# EAGLE design ButtonBreakout (EAGLE 9.5.1)
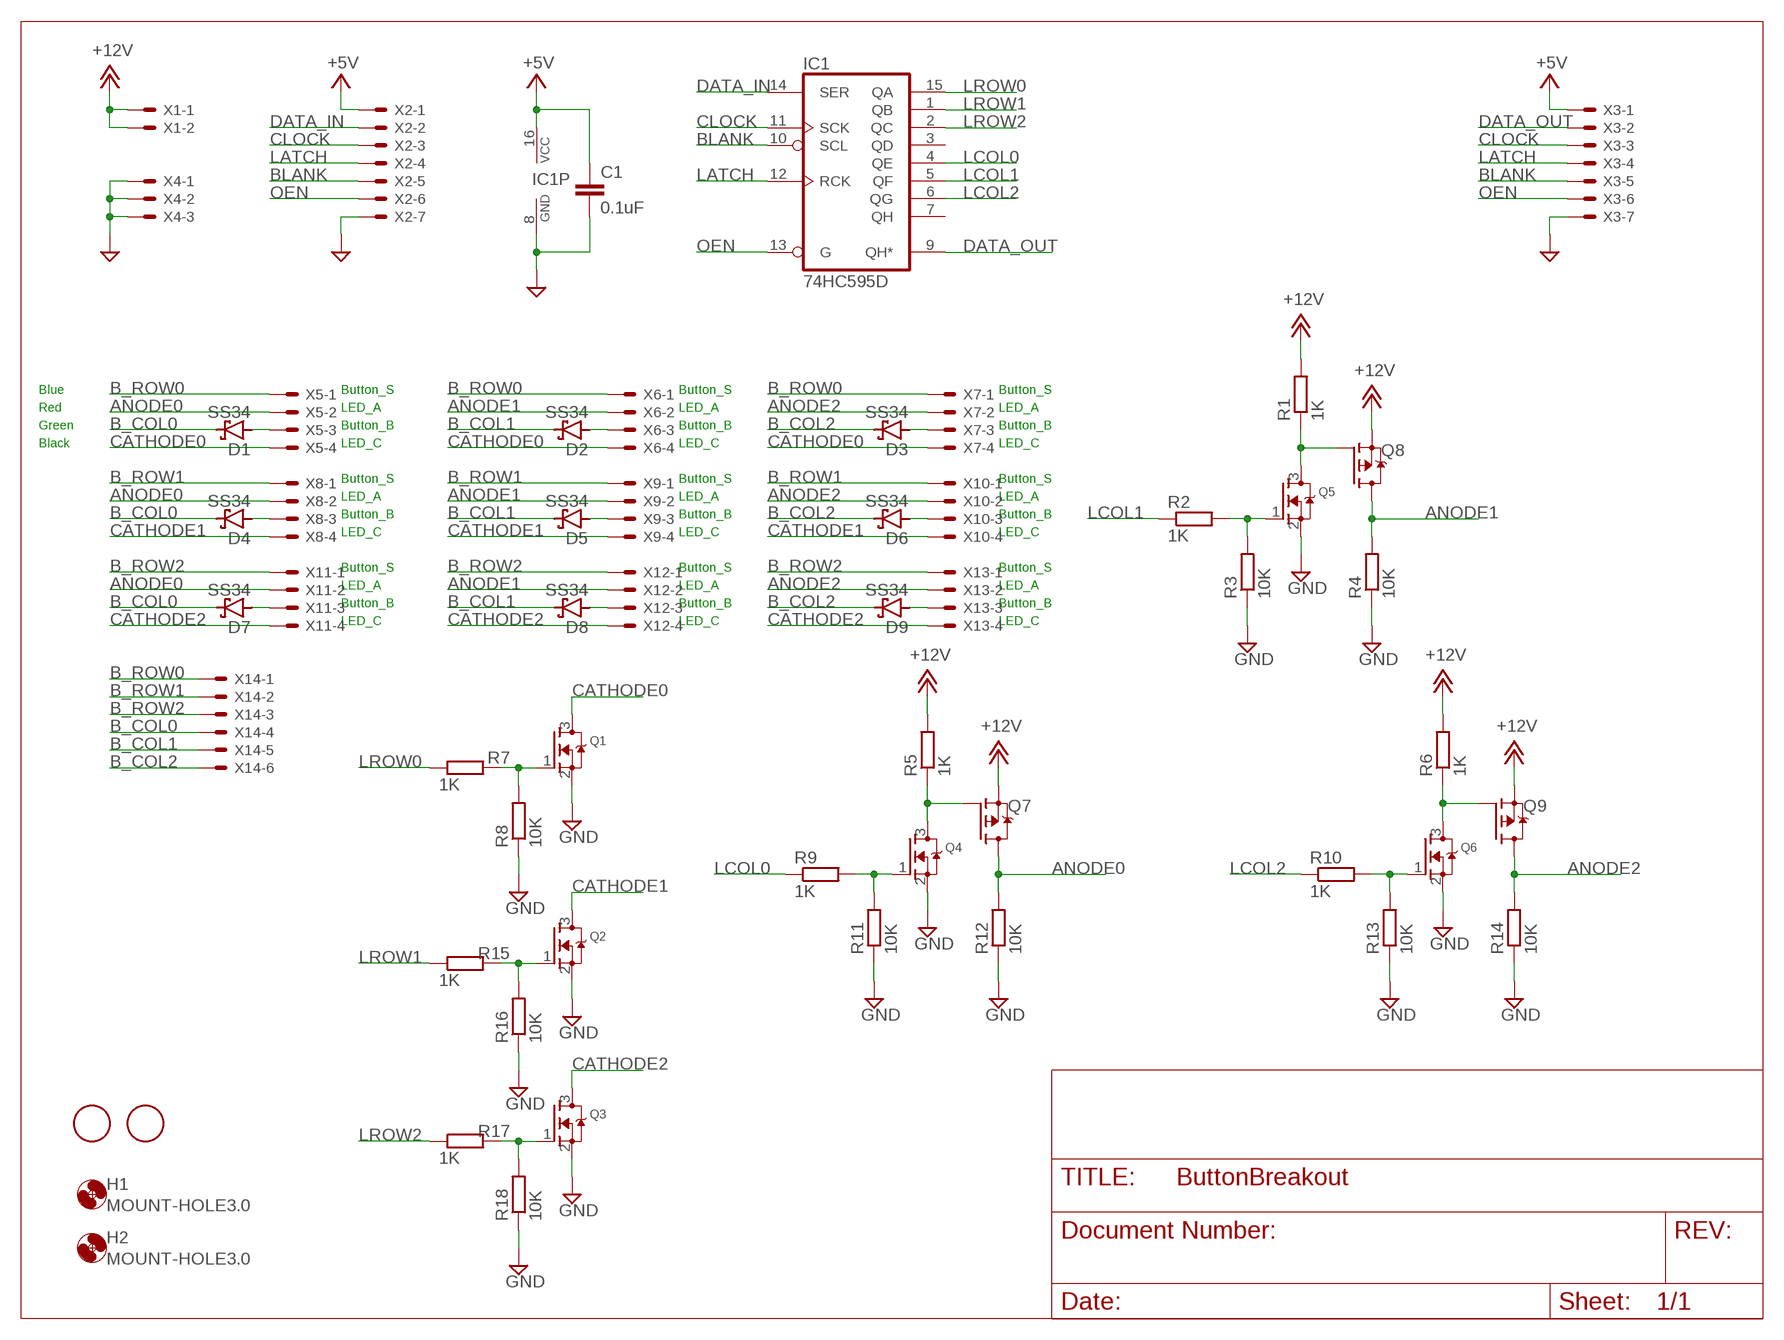
[diagram p0: schematic, sheet 1]

## Parts
C1  0.1uF  C-EUC0805  [C0805]
D1  SS34  [SMA]
D2  SS34  [SMA]
D3  SS34  [SMA]
D4  SS34  [SMA]
D5  SS34  [SMA]
D6  SS34  [SMA]
D7  SS34  [SMA]
D8  SS34  [SMA]
D9  SS34  [SMA]
F1  FIDUCIAL  [FIDUCIAL_1MM]
F2  FIDUCIAL  [FIDUCIAL_1MM]
H1  MOUNT-HOLE3.0  [3,0]
H2  MOUNT-HOLE3.0  [3,0]
IC1  74HC595D  [SO16]
Q1  AO3414SOT23  [SOT95P240X110-3N]
Q2  AO3414SOT23  [SOT95P240X110-3N]
Q3  AO3414SOT23  [SOT95P240X110-3N]
Q4  AO3414SOT23  [SOT95P240X110-3N]
Q5  AO3414SOT23  [SOT95P240X110-3N]
Q6  AO3414SOT23  [SOT95P240X110-3N]
Q7  AO3415  [SOT95P240X110-3N]
Q8  AO3415  [SOT95P240X110-3N]
Q9  AO3415  [SOT95P240X110-3N]
R1  1K  R-EU_R0805  [R0805]
R2  1K  R-EU_R0805  [R0805]
R3  10K  R-EU_R0805  [R0805]
R4  10K  R-EU_R0805  [R0805]
R5  1K  R-EU_R0805  [R0805]
R6  1K  R-EU_R0805  [R0805]
R7  1K  R-EU_R0805  [R0805]
R8  10K  R-EU_R0805  [R0805]
R9  1K  R-EU_R0805  [R0805]
R10  1K  R-EU_R0805  [R0805]
R11  10K  R-EU_R0805  [R0805]
R12  10K  R-EU_R0805  [R0805]
R13  10K  R-EU_R0805  [R0805]
R14  10K  R-EU_R0805  [R0805]
R15  1K  R-EU_R0805  [R0805]
R16  10K  R-EU_R0805  [R0805]
R17  1K  R-EU_R0805  [R0805]
R18  10K  R-EU_R0805  [R0805]
X1  JST-XH-02-PIN-LONG-PAD  [JST-XH-02-PACKAGE-LONG-PAD]
X2  JST-XH-07-PIN-LONG-PAD  [JST-XH-07-PACKAGE-LONG-PAD]
X3  JST-XH-07-PIN-LONG-PAD  [JST-XH-07-PACKAGE-LONG-PAD]
X4  JST-XH-03-PIN-LONG-PAD  [JST-XH-03-PACKAGE-LONG-PAD]
X5  JST-XH-04-PIN-LONG-PAD  [JST-XH-04-PACKAGE-LONG-PAD]
X6  JST-XH-04-PIN-LONG-PAD  [JST-XH-04-PACKAGE-LONG-PAD]
X7  JST-XH-04-PIN-LONG-PAD  [JST-XH-04-PACKAGE-LONG-PAD]
X8  JST-XH-04-PIN-LONG-PAD  [JST-XH-04-PACKAGE-LONG-PAD]
X9  JST-XH-04-PIN-LONG-PAD  [JST-XH-04-PACKAGE-LONG-PAD]
X10  JST-XH-04-PIN-LONG-PAD  [JST-XH-04-PACKAGE-LONG-PAD]
X11  JST-XH-04-PIN-LONG-PAD  [JST-XH-04-PACKAGE-LONG-PAD]
X12  JST-XH-04-PIN-LONG-PAD  [JST-XH-04-PACKAGE-LONG-PAD]
X13  JST-XH-04-PIN-LONG-PAD  [JST-XH-04-PACKAGE-LONG-PAD]
X14  JST-XH-06-PIN-LONG-PAD  [JST-XH-06-PACKAGE-LONG-PAD]

## Nets
+5V: C1.1 IC1.16(VCC) X2.1 X3.1
+12V: Q7.2(S) Q8.2(S) Q9.2(S) R1.2 R5.2 R6.2 X1.1 X1.2
ANODE0: Q7.3(D) R12.2 X5.2 X8.2 X11.2
ANODE1: Q8.3(D) R4.2 X6.2 X9.2 X12.2
ANODE2: Q9.3(D) R14.2 X7.2 X10.2 X13.2
B_COL0: D1.C D4.C D7.C X14.4
B_COL1: D2.C D5.C D8.C X14.5
B_COL2: D3.C D6.C D9.C X14.6
B_ROW0: X5.1 X6.1 X7.1 X14.1
B_ROW1: X8.1 X9.1 X10.1 X14.2
B_ROW2: X11.1 X12.1 X13.1 X14.3
BLANK: IC1.10(SCL) X2.5 X3.5
CATHODE0: Q1.3(D) X5.4 X6.4 X7.4
CATHODE1: Q2.3(D) X8.4 X9.4 X10.4
CATHODE2: Q3.3(D) X11.4 X12.4 X13.4
CLOCK: IC1.11(SCK) X2.3 X3.3
DATA_IN: IC1.14(SER) X2.2
DATA_OUT: IC1.9(QH*) X3.2
GND: C1.2 IC1.8(GND) Q1.2(S) Q2.2(S) Q3.2(S) Q4.2(S) Q5.2(S) Q6.2(S) R3.1 R4.1 R8.1 R11.1 R12.1 R13.1 R14.1 R16.1 R18.1 X2.7 X3.7 X4.1 X4.2 X4.3
LATCH: IC1.12(RCK) X2.4 X3.4
LCOL0: IC1.4(QE) R9.1
LCOL1: IC1.5(QF) R2.1
LCOL2: IC1.6(QG) R10.1
LROW0: IC1.15(QA) R7.1
LROW1: IC1.1(QB) R15.1
LROW2: IC1.2(QC) R17.1
N$1: Q2.1(G) R15.2 R16.2
N$2: Q3.1(G) R17.2 R18.2
N$3: Q5.3(D) Q8.1(G) R1.1
N$4: Q5.1(G) R2.2 R3.2
N$5: Q1.1(G) R7.2 R8.2
N$6: Q4.3(D) Q7.1(G) R5.1
N$7: D1.A X5.3
N$8: D2.A X6.3
N$9: D3.A X7.3
N$10: D4.A X8.3
N$11: D5.A X9.3
N$12: D6.A X10.3
N$13: D7.A X11.3
N$14: D8.A X12.3
N$15: D9.A X13.3
N$16: Q4.1(G) R9.2 R11.2
N$17: Q6.3(D) Q9.1(G) R6.1
N$18: Q6.1(G) R10.2 R13.2
OEN: IC1.13(G) X2.6 X3.6
Unconnected: IC1.3(QD) IC1.7(QH)

## Notes on the sheet
- Blue | Button_S | Button_S | Button_S
- Red | LED_A | LED_A | LED_A
- Green | Button_B | Button_B | Button_B
- Black | LED_C | LED_C | LED_C
- Button_S | Button_S | Button_S
- LED_A | LED_A | LED_A
- Button_B | Button_B | Button_B
- LED_C | LED_C | LED_C
- Button_S | Button_S | Button_S
- LED_A | LED_A | LED_A
- Button_B | Button_B | Button_B
- LED_C | LED_C | LED_C

## Library data of the parts
C1 = rcl:C-EU: CAPACITOR, European symbol; SPICEPREFIX: C
D1-D9 = tmc:SS34
F1 F2 = ECE388:FIDUCIAL: For use by pick and place machines to calibrate the vision/machine, 1mm By microbuilder.eu
H1 H2 = holes:MOUNT-HOLE: MOUNTING HOLE with drill center marker
IC1 = 74xx-eu:74*595: 8-bit SHIFT REGISTER, output latch
Q1-Q6 = tmc:AO3414
Q7-Q9 = tmc:AO3415
R1-R18 = rcl:R-EU_: RESISTOR, European symbol; SPICEPREFIX: R
X1 = Rembrandt Electronics - JST XH Connectors v1-0:JST-XH-02-PIN: JST XH Connector 2 Pin Wire to board connector. Pitch: 2,54 mm, (0.100") Number of pins: 2 Created by Rembrandt Electronics www.rembrandtelectronics.com
X2 X3 = Rembrandt Electronics - JST XH Connectors v1-0:JST-XH-07-PIN: JST XH Connector 2 Pin Wire to board connector. Pitch: 2,54 mm, (0.100") Number of pins: 7 Created by Rembrandt Electronics www.rembrandtelectronics.com
X4 = Rembrandt Electronics - JST XH Connectors v1-0:JST-XH-03-PIN: JST XH Connector 2 Pin Wire to board connector. Pitch: 2,54 mm, (0.100") Number of pins: 3 Created by Rembrandt Electronics www.rembrandtelectronics.com
X5-X13 = Rembrandt Electronics - JST XH Connectors v1-0:JST-XH-04-PIN: JST XH Connector 2 Pin Wire to board connector. Pitch: 2,54 mm, (0.100") Number of pins: 4 Created by Rembrandt Electronics www.rembrandtelectronics.com
X14 = Rembrandt Electronics - JST XH Connectors v1-0:JST-XH-06-PIN: JST XH Connector 2 Pin Wire to board connector. Pitch: 2,54 mm, (0.100") Number of pins: 6 Created by Rembrandt Electronics www.rembrandtelectronics.com

## Board
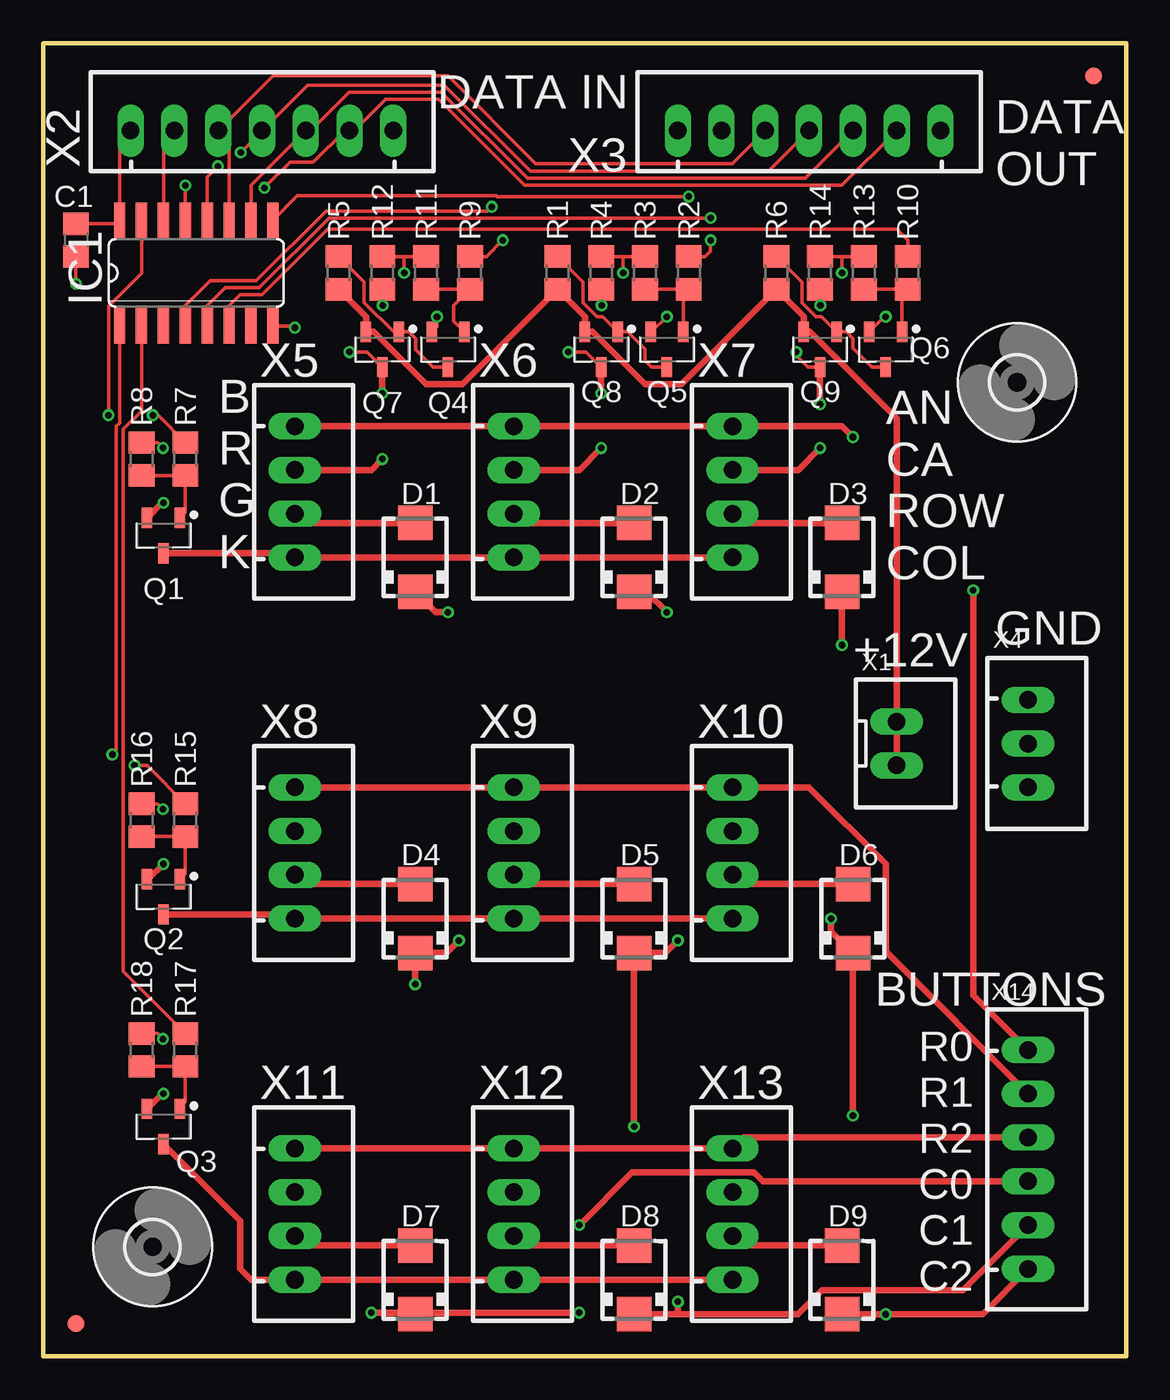
[diagram p1: board, top side]
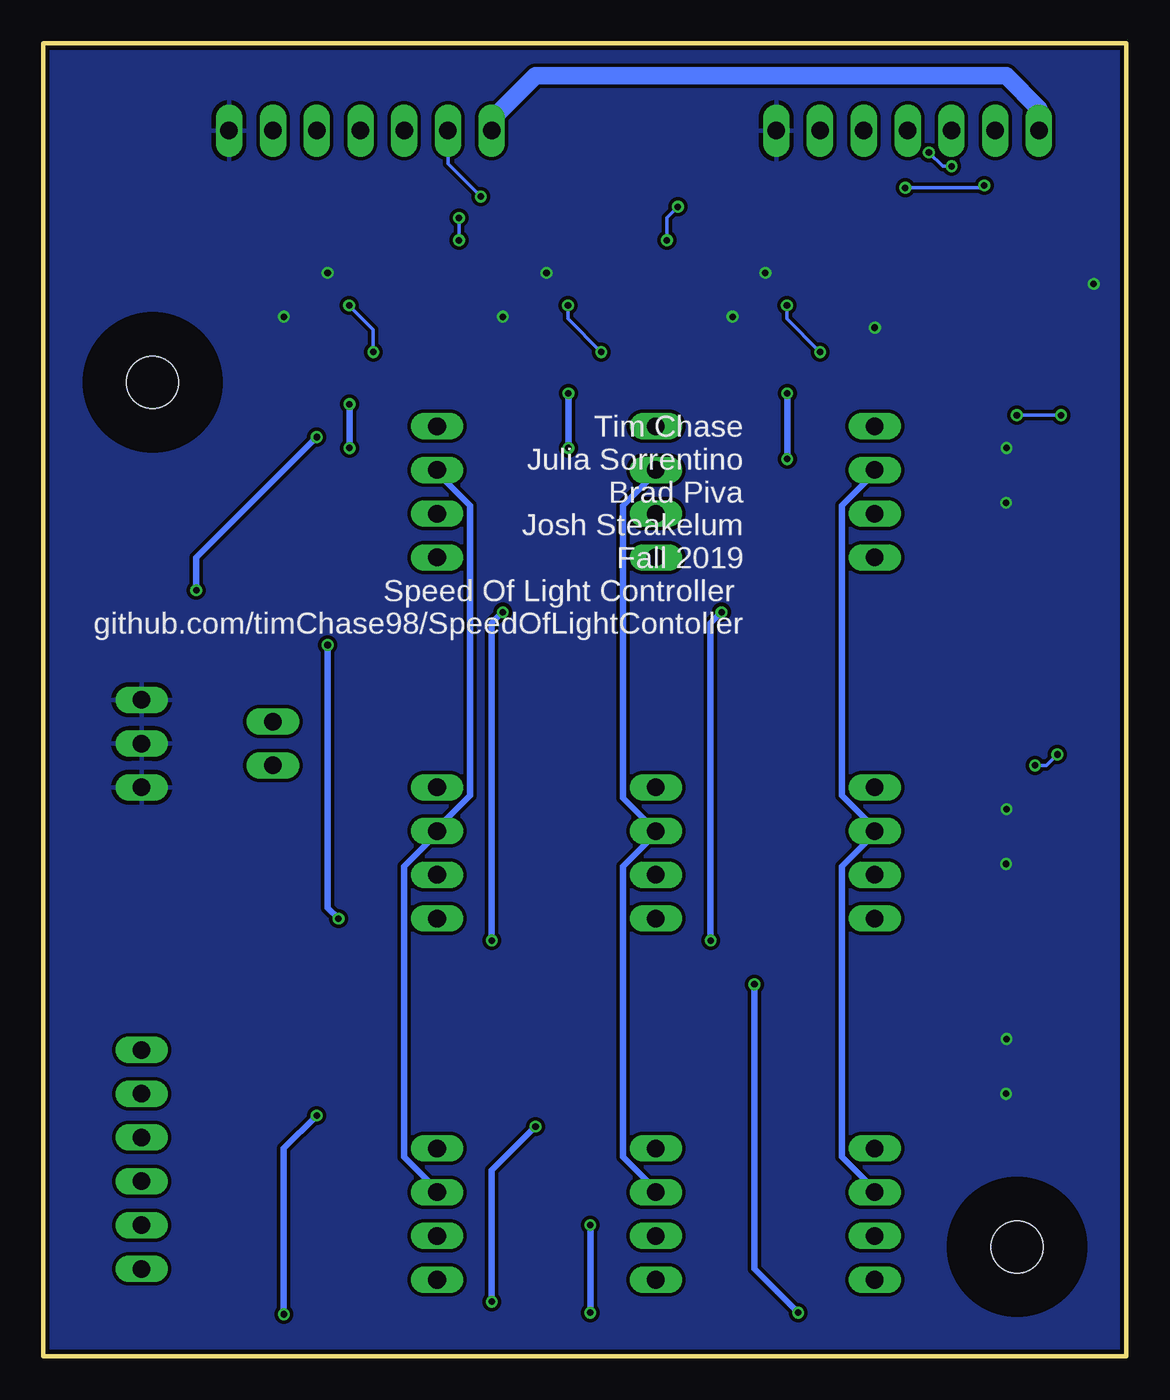
[diagram p2: board, bottom side, seen from below]

Size 62.87 x 76.2 mm. Coordinates in mm from the lower left corner, seen from the top.
Outline: 0,0 62.87,0 62.87,76.2 0,76.2 0,0
Copper layers (1*16): Top 0.035mm / dielectric 1.5mm / Bottom 0.035mm
Design rules "Dirty8TS": minimum track width 8mil, minimum drill 15mil, track to track 8mil, track to pad 8mil, pad to pad 8mil, via to via 8mil, smd to smd 0mil, copper to edge 10mil, drill to drill 10mil, minimum pad ring 10mil, minimum via ring 6mil, stop-mask expansion 2mil, vias tented up to drill 25mil, thermal gap 10mil

### Footprints (pad centres in the part's own frame; a part is rotated, then mirrored left to right if it is on the bottom)
C0805 = smd 1.3 x 1.5: 1 -0.95,0; 2 0.95,0
SMA = smd 2 x 2: A 2,0; C -2,0
FIDUCIAL_1MM = smd 1 x 1: 1 0,0
3,0 = hole 3: 0,0
SO16 = smd 0.66 x 2.032: 1 -4.445,-3.073; 2 -3.175,-3.073; 3 -1.905,-3.073; 4 -0.635,-3.073; 5 0.635,-3.073; 6 1.905,-3.073; 7 3.175,-3.073; 8 4.445,-3.073; 9 4.445,3.073; 10 3.175,3.073; 11 1.905,3.073; 12 0.635,3.073; 13 -0.635,3.073; 14 -1.905,3.073; 15 -3.175,3.073; 16 -4.445,3.073
SOT95P240X110-3N = smd 1.18 x 0.609: 1 -1.024,0.95; 2 -1.024,-0.95; 3 1.024,0
R0805 = smd 1.3 x 1.5: 1 -0.95,0; 2 0.95,0
JST-XH-02-PACKAGE-LONG-PAD = drill 1.016 long: 1 -1.27,0; 2 1.27,0
JST-XH-07-PACKAGE-LONG-PAD = drill 1.016 long: 1 -7.62,0; 2 -5.08,0; 3 -2.54,0; 4 0,0; 5 2.54,0; 6 5.08,0; 7 7.62,0
JST-XH-03-PACKAGE-LONG-PAD = drill 1.016 long: 1 -2.54,0; 2 0,0; 3 2.54,0
JST-XH-04-PACKAGE-LONG-PAD = drill 1.016 long: 1 -3.81,0; 2 -1.27,0; 3 1.27,0; 4 3.81,0
JST-XH-06-PACKAGE-LONG-PAD = drill 1.016 long: 1 -6.35,0; 2 -3.81,0; 3 -1.27,0; 4 1.27,0; 5 3.81,0; 6 6.35,0

### Placement (x,y rotation side)
C1  1.91,64.77 270 top
D1  21.59,46.35 90 top
D2  34.29,46.35 90 top
D3  46.35,46.35 90 top
D4  21.59,25.4 90 top
D5  34.29,25.4 90 top
D6  46.99,25.4 90 top
D7  21.59,4.45 90 top
D8  34.29,4.45 90 top
D9  46.35,4.45 90 top
F1  1.91,1.91 0 top
F2  60.96,74.3 0 top
H1  6.35,6.35 0 top
H2  56.52,56.52 0 top
IC1  8.89,62.87 0 top
Q1  6.99,47.62 270 top
Q2  6.99,26.67 270 top
Q3  6.99,13.34 270 top
Q4  23.5,58.42 270 top
Q5  36.2,58.42 270 top
Q6  48.9,58.42 270 top
Q7  19.68,58.42 270 top
Q8  32.38,58.42 270 top
Q9  45.09,58.42 270 top
R1  29.84,62.87 270 top
R2  37.47,62.87 270 top
R3  34.92,62.87 270 top
R4  32.38,62.87 270 top
R5  17.14,62.87 270 top
R6  42.55,62.87 270 top
R7  8.26,52.07 270 top
R8  5.71,52.07 270 top
R9  24.77,62.87 270 top
R10  50.16,62.87 270 top
R11  22.23,62.87 270 top
R12  19.68,62.87 270 top
R13  47.62,62.87 270 top
R14  45.09,62.87 270 top
R15  8.26,31.11 270 top
R16  5.71,31.11 270 top
R17  8.26,17.78 270 top
R18  5.71,17.78 270 top
X1  49.53,35.56 270 top
X2  12.7,71.12 0 top
X3  44.45,71.12 0 top
X4  57.15,35.56 270 top
X5  14.61,50.16 270 top
X6  27.3,50.16 270 top
X7  40.01,50.16 270 top
X8  14.61,29.21 270 top
X9  27.3,29.21 270 top
X10  40.01,29.21 270 top
X11  14.61,8.26 270 top
X12  27.3,8.26 270 top
X13  40.01,8.26 270 top
X14  57.15,11.43 270 top

### Tracks (layer width: path | path; a pad name or v marks a point on that pad's centre or on a via)
+5V
  Top 0.203: X2.1 4.45,70.48 IC1.16 4.23,65.72 C1.1
  Bottom 1.016: X3.1 36.83,71.75 34.29,74.3 6.99,74.3 5.08,72.39 X2.1
+12V
  Top 0.381: R5.2 18.73,60.33 Q7.2 19.18,59.44 22.22,56.41 24.34,56.41 R1.2 31.43,60.33 Q8.2 31.88,59.44 34.92,56.41 37.04,56.41 R6.2 44.13,60.33 Q9.2 44.49,59.44 49.53,54.4 X1.1 X1.2
ANODE0  (via drill 0.38)
  Top 0.203: v19.7,60.98 19.68,61 R12.2 | Q7.3 18.81,58.27 v17.78,58.27
  Top 0.381: Q7.3 v19.68,55.88 | v19.68,52.07 19.05,51.44 X5.2
  Bottom 0.203: v17.78,58.27 19.7,60.2 v19.7,60.98
  Bottom 0.381: X5.2 14.61,51.29 16.52,49.37 16.52,32.54 14.61,30.62 X8.2 14.61,30.34 16.52,28.42 16.52,11.59 14.61,9.67 X11.2 | v19.68,55.88 v19.68,52.07
ANODE1  (via drill 0.38)
  Top 0.203: v32.41,60.98 32.38,61 R4.2 | Q8.3 31.51,58.27 v30.48,58.27
  Top 0.381: Q8.3 v32.38,55.88 | v32.38,52.7 31.11,51.44 X6.2
  Bottom 0.203: v30.48,58.27 32.41,60.2 v32.41,60.98
  Bottom 0.381: X6.2 27.3,51.29 29.22,49.37 29.22,32.4 X9.2 27.3,30.34 29.22,28.42 29.22,11.59 27.3,9.67 X12.2 | v32.38,55.88 v32.38,52.7
ANODE2  (via drill 0.38)
  Top 0.203: v45.1,60.98 45.09,61 R14.2 | Q9.3 44.37,57.4 43.7,58.07 v43.7,58.27
  Top 0.381: Q9.3 v45.09,55.24 | v45.09,52.7 43.81,51.44 X7.2
  Bottom 0.203: v43.7,58.27 43.7,59.58 v45.1,60.98
  Bottom 0.381: X7.2 40.01,51.29 38.09,49.37 38.09,32.54 40.01,30.62 X10.2 40.01,30.34 41.92,28.42 41.92,11.59 40.01,9.67 X13.2 | v45.09,55.24 v45.09,52.7
B_COL0  (via drill 0.38)
  Top 0.381: v31.11,2.54 21.68,2.54 D7.C 21.5,2.54 v19.05,2.54 | X14.4 41.77,10.16 41.25,10.68 34.18,10.68 v31.11,7.62 | v21.59,21.59 D4.C 23.4,23.4 v24.13,24.13 | D1.C 22.77,43.18 v23.5,43.18
  Bottom 0.381: v31.11,2.54 v31.11,7.62 | v21.59,21.59 21.59,5.08 v19.05,2.54 | v23.5,43.18 24.13,42.55 v24.13,24.13
B_COL1  (via drill 0.38)
  Top 0.381: D8.C 36.83,2.44 | 36.83,2.44 43.8,2.44 45.19,3.84 53.37,3.84 X14.5 | D2.C 35.02,44.35 v36.2,43.18 | v36.83,24.13 36.1,23.4 D5.C v34.29,13.34 | v36.83,3.17 36.83,2.44
  Bottom 0.381: v36.2,43.18 36.83,42.55 v36.83,24.13 | v34.29,13.34 36.83,10.79 v36.83,3.17
B_COL2  (via drill 0.38)
  Top 0.381: D9.C v48.9,2.44 54.52,2.44 X14.6 | D3.C v46.35,41.27 | v45.72,25.4 45.72,24.67 D6.C v46.99,13.97
  Bottom 0.381: v46.35,41.27 46.35,26.04 v45.72,25.4 | v46.99,13.97 48.9,12.06 v48.9,2.44
B_ROW0  (via drill 0.38)
  Top 0.381: X5.1 X6.1 X7.1 46.35,53.98 v46.99,53.34 | v53.98,44.45 53.98,20.95 X14.1
  Bottom 0.381: v46.99,53.34 53.98,46.35 v53.98,44.45
B_ROW1
  Top 0.381: X8.1 X9.1 X10.1 44.45,33.02 48.9,28.57 48.9,23.5 X14.2
B_ROW2
  Top 0.381: X11.1 X12.1 X13.1 40.64,12.7 X14.3
BLANK
  Top 0.203: IC1.10 12.06,67.94 X2.5 15.51,71.12 17.75,73.36 23.11,73.36 28.11,68.35 44.22,68.35 X3.5
CATHODE0
  Top 0.381: Q1.3 14.36,46.6 X5.4 X6.4 X7.4
CATHODE1
  Top 0.203: Q2.3 6.99,25.57 7.16,25.4
  Top 0.381: X10.4 X9.4 X8.4 14.36,25.64 Q2.3
CATHODE2
  Top 0.203: Q3.3 6.99,12.06
  Top 0.381: Q3.3 11.43,7.87 11.43,5.08 12.06,4.45 X11.4 X12.4 X13.4
CLOCK
  Top 0.203: IC1.11 10.79,70.48 X2.3 13.34,74.3 23.5,74.3 28.57,69.22 40.01,69.22 X3.3
DATA_IN
  Top 0.203: X2.2 6.99,70.48 IC1.14
DATA_OUT  (via drill 0.38)
  Top 0.203: v37.47,67.3 26.35,67.3 26.3,67.35 14.74,67.35 IC1.9
  Bottom 0.203: v37.47,67.3 39.37,69.2 X3.2
GND  (via drill 0.38)
  Top 0.203: R11.1 20.95,63.81 | 20.95,63.81 R12.1 | 20.95,63.81 v20.95,62.87 | R3.1 33.66,63.81 | 33.66,63.81 R4.1 | 33.66,63.81 v33.66,62.87 | R14.1 46.35,63.81 | 46.35,63.81 R13.1 | 46.35,63.81 v46.35,62.87 | R8.1 6.64,53.02 v6.96,52.7 | C1.2 v1.91,62.23 | IC1.8 14.5,59.79 v14.61,59.69 | R16.1 6.64,32.06 v6.96,31.75 | R18.1 6.64,18.73 v6.96,18.41 | Q4.2 22.86,59.76 v22.86,60.33 | Q5.2 35.31,59.44 v36.2,60.33 | Q6.2 48.83,60.33 v48.9,60.33
  Top 0.381: Q3.2 6.92,15.24 v6.99,15.24 | Q2.2 6.1,27.7 v6.99,28.57 | Q1.2 6.92,49.53 v6.99,49.53
  pour Bottom: 0,76.2 62.87,76.2 62.87,0 0,0
LATCH  (via drill 0.38)
  Top 0.203: v11.47,69.85 12.7,71.08 X2.4 15.34,73.76 23.27,73.76 28.28,68.76 42.09,68.76 X3.4 | v10.15,69.05 9.53,68.43 IC1.12
  Bottom 0.203: v11.47,69.85 10.67,69.05 v10.15,69.05
LCOL0  (via drill 0.38)
  Top 0.203: IC1.4 8.26,60.96 9.7,62.41 12.36,62.41 16.41,66.46 25.79,66.46 v26.04,66.7 | v26.67,64.76 25.73,63.81 R9.1
  Bottom 0.203: v26.04,66.7 26.67,66.06 v26.67,64.76
LCOL1  (via drill 0.38)
  Top 0.203: IC1.5 9.53,60.96 10.57,62 12.53,62 16.58,66.05 v38.73,66.05 | v38.73,64.76 38.73,64.14 38.41,63.81 R2.1
  Bottom 0.203: v38.73,66.05 v38.73,64.76
LCOL2
  Top 0.203: R10.1 50.16,64.77 49.53,65.41 16.51,65.41 12.7,61.59 11.43,61.59 10.79,60.96 IC1.6
LROW0  (via drill 0.38)
  Top 0.203: IC1.15 5.71,62.84 3.81,60.93 3.81,54.62 v3.8,54.61 | v6.36,54.61 6.67,54.61 R7.1
  Bottom 0.203: v3.8,54.61 v6.36,54.61
LROW1  (via drill 0.38)
  Top 0.203: IC1.1 4.45,54.16 4.25,53.97 4.25,35.17 v4.01,34.92 | v5.31,34.29 6.03,34.29 R15.1
  Bottom 0.203: v4.01,34.92 4.65,34.29 v5.31,34.29
LROW2
  Top 0.203: IC1.2 5.71,54.85 4.66,53.8 4.66,22.32 R17.1
N$1
  Top 0.203: R16.2 R15.2 8.26,28.02 Q2.1
N$2
  Top 0.203: R18.2 R17.2 8.26,14.76 7.93,14.44 Q3.1
N$3
  Top 0.203: R1.1 31.33,62.33 31.33,61.14 32.14,60.33 32.45,60.33 Q8.1 33.92,59.44 34.92,58.44 34.92,57.78 35.31,57.4 Q5.3
N$4
  Top 0.203: R3.2 R2.2 37.15,61.59 Q5.1
N$5
  Top 0.203: R8.2 R7.2 8.26,48.97 Q1.1
N$6
  Top 0.203: R5.1 18.63,62.33 18.63,61.14 20.32,59.44 Q7.1 21.22,59.44 21.6,59.06 21.6,58.41 22.61,57.4 Q4.3
N$7
  Top 0.381: X5.3 15.14,48.35 D1.A
N$8
  Top 0.381: X6.3 27.84,48.35 D2.A
N$9
  Top 0.381: X7.3 40.55,48.35 D3.A
N$10
  Top 0.381: D4.A 15.14,27.4 X8.3
N$11
  Top 0.381: D5.A 27.84,27.4 X9.3
N$12
  Top 0.381: X10.3 40.55,27.4 D6.A
N$13
  Top 0.381: X11.3 15.14,6.45 D7.A
N$14
  Top 0.381: X12.3 27.84,6.45 D8.A
N$15
  Top 0.381: X13.3 40.55,6.45 D9.A
N$16
  Top 0.203: R11.2 R9.2 23.81,60.96 23.81,60.08 Q4.1
N$17
  Top 0.203: R6.1 44.03,62.33 44.03,61.14 44.84,60.33 45.15,60.33 Q9.1 46.6,59.44 46.99,59.05 46.99,58.49 48.08,57.4 Q6.3
N$18
  Top 0.203: R13.2 R10.2 49.84,61.59 Q6.1
OEN  (via drill 0.38)
  Top 0.203: v12.84,67.81 14.33,69.29 15.68,69.29 17.51,71.12 X2.6 18.05,71.12 19.88,72.95 22.94,72.95 27.94,67.94 46.35,67.94 X3.6 | v8.26,67.94 IC1.13
  Bottom 0.203: v12.84,67.81 8.39,67.81 v8.26,67.94

### Text on the board
tNames: DATA IN | DATA / OUT | B / R / G / K | AN / CA / ROW / COL | GND | +12V | BUTTONS
bNames: Tim Chase / Julia Sorrentino / Brad Piva / Josh Steakelum / Fall 2019 / Speed Of Light Controller / github.com/timChase98/SpeedOfLightContoller
_tsilk: R0 / R1 / R2 / C0 / C1 / C2